# Altium schematic sheet BUCK CONVERTERS.SchDoc: Buck Converters
size 558 x 431 mm; CheckedBy: Lance Bantoto; Engineer: Cindy Li; Organization: UW Robotics; Address1: 200 University Avenue; Address2: Waterloo; Address3: Ontario; Address4: Canada N2L 3G6; DocumentNumber: 3; Revision: 1; SheetNumber: 3; SheetTotal: 23
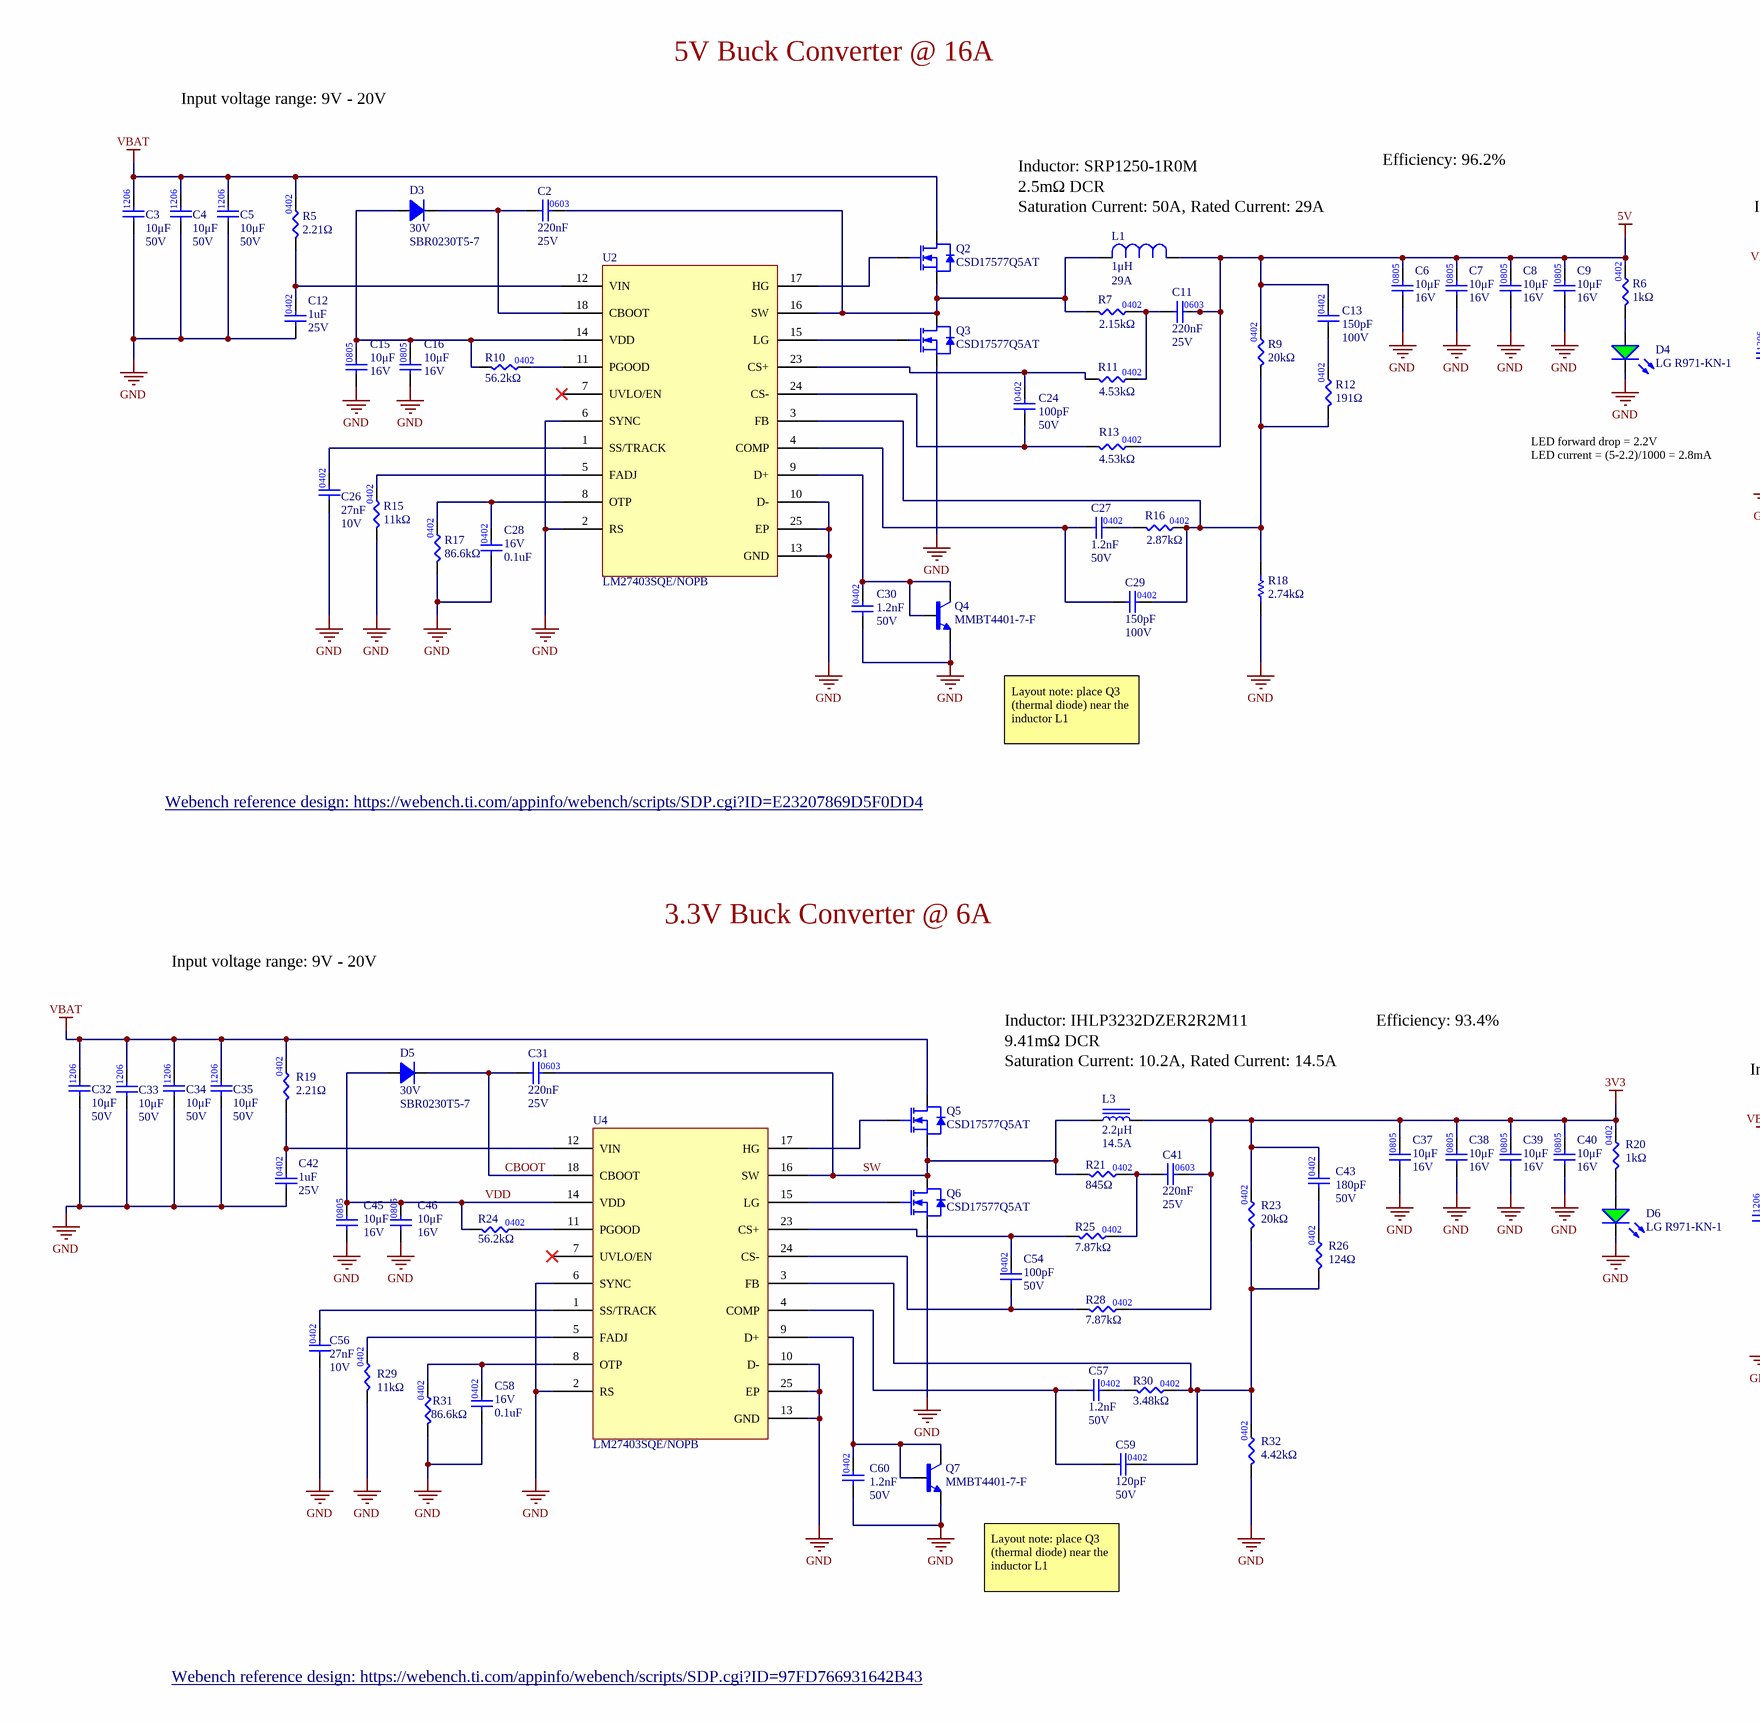
[diagram p0: BUCK CONVERTERS.SchDoc, left]
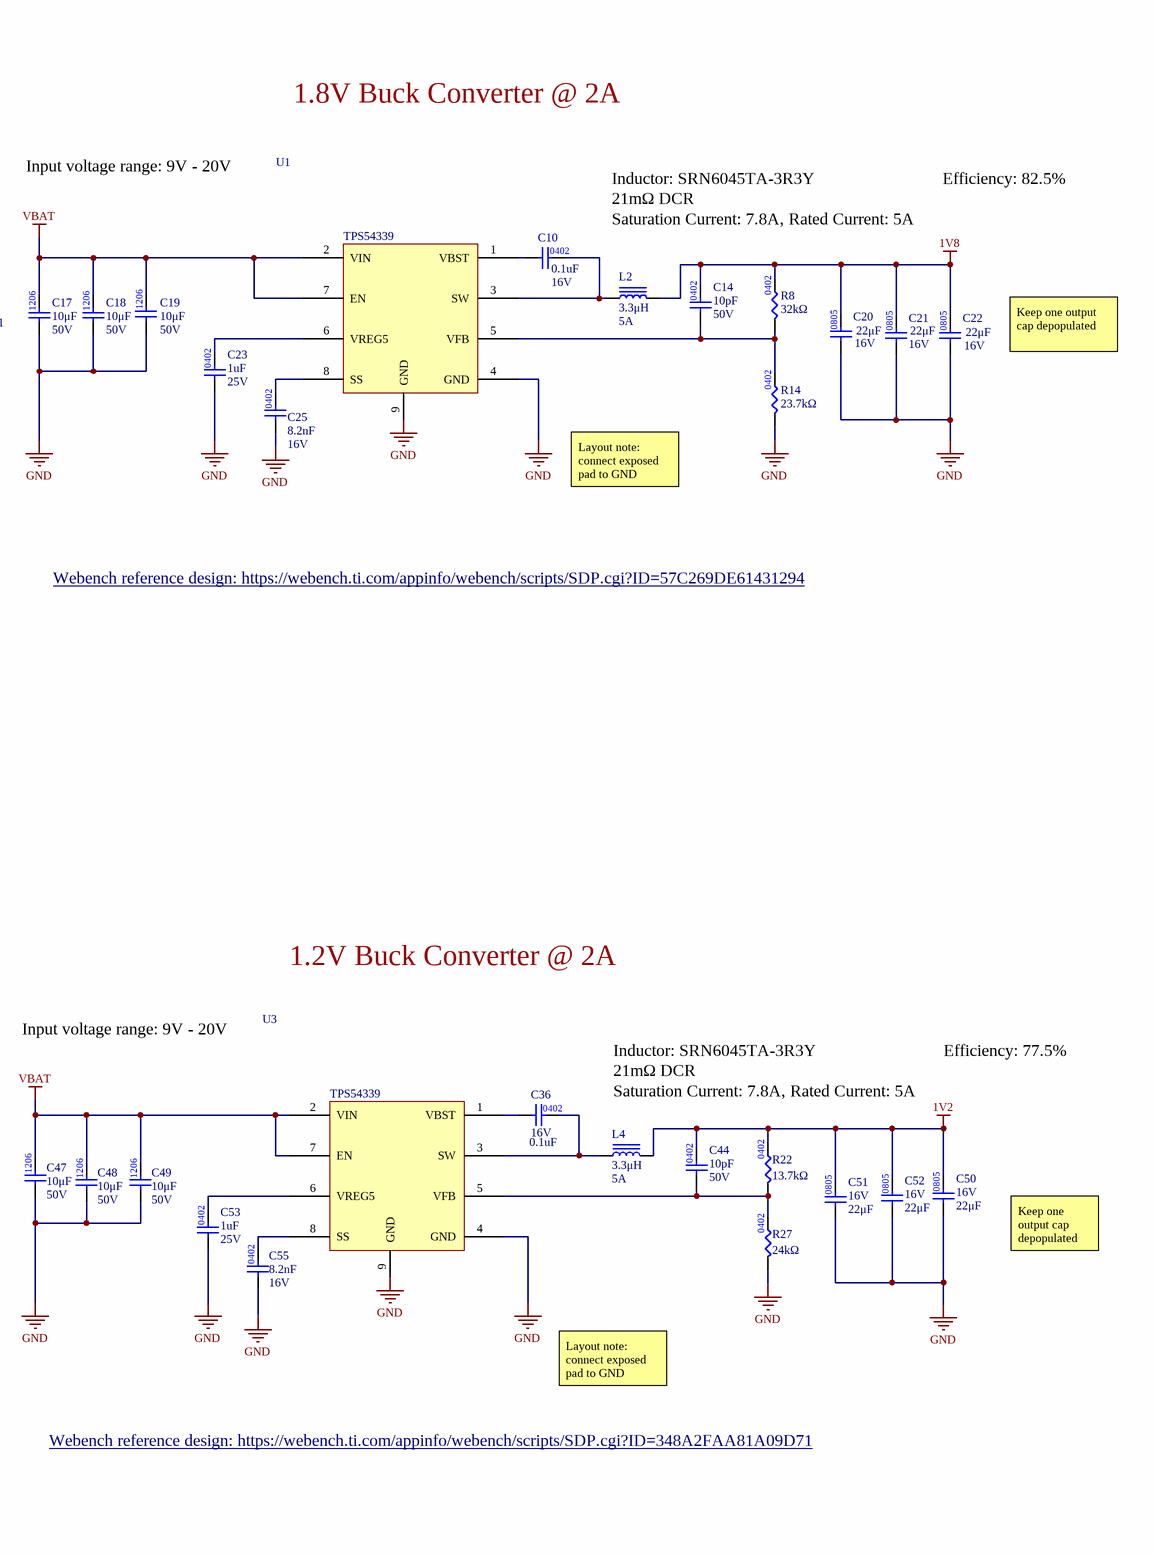
[diagram p1: BUCK CONVERTERS.SchDoc, right]

## Parts
C2  Capacitance: 220nF  Rated DC Voltage (URdc): 25V  [CAP0402]  (hidden comment: CAP_0.22uF_25V_X5R_0402)
C3  value 10μF  Voltage Rating: 50V  [CAP1210]  (hidden comment: CAP_10uF_50V_1210)
C4  value 10μF  Voltage Rating: 50V  [CAP1210]  (hidden comment: CAP_10uF_50V_1210)
C5  value 10μF  Voltage Rating: 50V  [CAP1210]  (hidden comment: CAP_10uF_50V_1210)
C6  value 10μF  Voltage Rating: 16V  [CAP2012]  (hidden comment: CAP_10uF_16V_0805)
C7  value 10μF  Voltage Rating: 16V  [CAP2012]  (hidden comment: CAP_10uF_16V_0805)
C8  value 10μF  Voltage Rating: 16V  [CAP2012]  (hidden comment: CAP_10uF_16V_0805)
C9  value 10μF  Voltage Rating: 16V  [CAP2012]  (hidden comment: CAP_10uF_16V_0805)
C10  Rated DC Voltage (URdc): 16V  Capacitance: 0.1uF  [CAP0402]  (hidden comment: CAP_0.1uF_16V_X7R_0402)
C11  Capacitance: 220nF  Rated DC Voltage (URdc): 25V  [CAP0402]  (hidden comment: CAP_0.22uF_25V_X5R_0402)
C12  Capacitance: 1uF  Voltage: 25V  [CAP0402]  (hidden comment: CAP_1uF_25V_0402)
C13  Capacitance: 150pF  Rated DC Voltage (URdc): 100V  [CAP0402]  (hidden comment: CAP_150pF_100V_NP0_0402)
C14  Capacitance: 10pF  Voltage: 50V  [CAP0402]  (hidden comment: CAP_10pF_50V_0402)
C15  value 10μF  Voltage Rating: 16V  [CAP2012]  (hidden comment: CAP_10uF_16V_0805)
C16  value 10μF  Voltage Rating: 16V  [CAP2012]  (hidden comment: CAP_10uF_16V_0805)
C17  value 10μF  Voltage Rating: 50V  [CAP1210]  (hidden comment: CAP_10uF_50V_1210)
C18  value 10μF  Voltage Rating: 50V  [CAP1210]  (hidden comment: CAP_10uF_50V_1210)
C19  value 10μF  Voltage Rating: 50V  [CAP1210]  (hidden comment: CAP_10uF_50V_1210)
C20  value 22μF  Voltage Rating: 16V  [CAP2012]  (hidden comment: CAP_22uF_16V_0805)
C21  value 22μF  Voltage Rating: 16V  [CAP2012]  (hidden comment: CAP_22uF_16V_0805)
C22  value 22μF  Voltage Rating: 16V  [CAP2012]  (hidden comment: CAP_22uF_16V_0805)
C23  Capacitance: 1uF  Voltage: 25V  [CAP0402]  (hidden comment: CAP_1uF_25V_0402)
C24  Capacitance: 100pF  Voltage: 50V  [CAP0402]  (hidden comment: CAP_100pF_50V_0402)
C25  Capacitance: 8.2nF  Voltage: 16V  [CAP0402]  (hidden comment: CAP_8.2nF_16V_0402)
C26  Capacitance: 27nF  Rated DC Voltage (URdc): 10V  [CAP0402]  (hidden comment: CAP_0.027uF_10V_X7R_0402)
C27  Capacitance: 1.2nF  Rated DC Voltage (URdc): 50V  [CAP0402]  (hidden comment: CAP_1.2nF_50V_X7R_0402)
C28  Rated DC Voltage (URdc): 16V  Capacitance: 0.1uF  [CAP0402]  (hidden comment: CAP_0.1uF_16V_X7R_0402)
C29  Capacitance: 150pF  Rated DC Voltage (URdc): 100V  [CAP0402]  (hidden comment: CAP_150pF_100V_NP0_0402)
C30  Capacitance: 1.2nF  Rated DC Voltage (URdc): 50V  [CAP0402]  (hidden comment: CAP_1.2nF_50V_X7R_0402)
C31  Capacitance: 220nF  Rated DC Voltage (URdc): 25V  [CAP0402]  (hidden comment: CAP_0.22uF_25V_X5R_0402)
C32  value 10μF  Voltage Rating: 50V  [CAP1210]  (hidden comment: CAP_10uF_50V_1210)
C33  value 10μF  Voltage Rating: 50V  [CAP1210]  (hidden comment: CAP_10uF_50V_1210)
C34  value 10μF  Voltage Rating: 50V  [CAP1210]  (hidden comment: CAP_10uF_50V_1210)
C35  value 10μF  Voltage Rating: 50V  [CAP0805]  (hidden comment: CAP_10uF_50V_1210)
C36  Rated DC Voltage (URdc): 16V  Capacitance: 0.1uF  [CAP0402]  (hidden comment: CAP_0.1uF_16V_X7R_0402)
C37  value 10μF  Voltage Rating: 16V  [CAP2012]  (hidden comment: CAP_10uF_16V_0805)
C38  value 10μF  Voltage Rating: 16V  [CAP2012]  (hidden comment: CAP_10uF_16V_0805)
C39  value 10μF  Voltage Rating: 16V  [CAP2012]  (hidden comment: CAP_10uF_16V_0805)
C40  value 10μF  Voltage Rating: 16V  [CAP2012]  (hidden comment: CAP_10uF_16V_0805)
C41  Capacitance: 220nF  Rated DC Voltage (URdc): 25V  [CAP0402]  (hidden comment: CAP_0.22uF_25V_X5R_0402)
C42  Capacitance: 1uF  Voltage: 25V  [CAP0402]  (hidden comment: CAP_1uF_25V_0402)
C43  Capacitance: 180pF  Voltage: 50V  [CAP0402]  (hidden comment: CAP_180pF_50V_0402)
C44  Capacitance: 10pF  Voltage: 50V  [CAP0402]  (hidden comment: CAP_10pF_50V_0402)
C45  value 10μF  Voltage Rating: 16V  [CAP2012]  (hidden comment: CAP_10uF_16V_0805)
C46  value 10μF  Voltage Rating: 16V  [CAP2012]  (hidden comment: CAP_10uF_16V_0805)
C47  value 10μF  Voltage Rating: 50V  [CAP1210]  (hidden comment: CAP_10uF_50V_1210)
C48  value 10μF  Voltage Rating: 50V  [CAP1210]  (hidden comment: CAP_10uF_50V_1210)
C49  value 10μF  Voltage Rating: 50V  [CAP1210]  (hidden comment: CAP_10uF_50V_1210)
C50  value 22μF  Voltage Rating: 16V  [CAP2012]  (hidden comment: CAP_22uF_16V_0805)
C51  value 22μF  Voltage Rating: 16V  [CAP2012]  (hidden comment: CAP_22uF_16V_0805)
C52  value 22μF  Voltage Rating: 16V  [CAP2012]  (hidden comment: CAP_22uF_16V_0805)
C53  Capacitance: 1uF  Voltage: 25V  [CAP0402]  (hidden comment: CAP_1uF_25V_0402)
C54  Capacitance: 100pF  Voltage: 50V  [CAP0402]  (hidden comment: CAP_100pF_50V_0402)
C55  Capacitance: 8.2nF  Voltage: 16V  [CAP0402]  (hidden comment: CAP_8.2nF_16V_0402)
C56  Capacitance: 27nF  Rated DC Voltage (URdc): 10V  [CAP0402]  (hidden comment: CAP_0.027uF_10V_X7R_0402)
C57  Capacitance: 1.2nF  Rated DC Voltage (URdc): 50V  [CAP0402]  (hidden comment: CAP_1.2nF_50V_X7R_0402)
C58  Rated DC Voltage (URdc): 16V  Capacitance: 0.1uF  [CAP0402]  (hidden comment: CAP_0.1uF_16V_X7R_0402)
C59  Capacitance: 120pF  Voltage: 50V  [CAP0402]  (hidden comment: CAP_120pF_50V_0402)
C60  Capacitance: 1.2nF  Rated DC Voltage (URdc): 50V  [CAP0402]  (hidden comment: CAP_1.2nF_50V_X7R_0402)
D3  value 30V  [SOD523]  (hidden comment: SBR0230T5-7)
D4  Manufacturer Part Number 1: LG R971-KN-1  [LED_0805_GREEN]  (hidden comment: DIO_LED_G)
D5  value 30V  [SOD523]  (hidden comment: SBR0230T5-7)
D6  Manufacturer Part Number 1: LG R971-KN-1  [LED_0805_GREEN]  (hidden comment: DIO_LED_G)
L1  Current Rating: 29A  Inductance: 1μH  [IND_BOURNS_SRP1250]  (hidden comment: IND_1uH_29A)
L2  Current Rating: 5A  Inductance: 3.3μH  [IND_SRN6045TA-3R3Y]  (hidden comment: IND_3.3uH_5A)
L3  Current Rating: 14.5A  Inductance: 2.2μH  [IND_VISHAY_IHLP3232DZER2R2M11]  (hidden comment: IND_2.2uH_14.5A)
L4  Current Rating: 5A  Inductance: 3.3μH  [IND_SRN6045TA-3R3Y]  (hidden comment: IND_3.3uH_5A)
Q2  Manufacturer Part Number 1: CSD17577Q5AT  [MOSFET_CSD19531Q5A]  (hidden comment: NMOS_30V_60A)
Q3  Manufacturer Part Number 1: CSD17577Q5AT  [MOSFET_CSD19531Q5A]  (hidden comment: NMOS_30V_60A)
Q4  MMBT4401-7-F  [MMBT4401-7-F]
Q5  Manufacturer Part Number 1: CSD17577Q5AT  [MOSFET_CSD19531Q5A]  (hidden comment: NMOS_30V_60A)
Q6  Manufacturer Part Number 1: CSD17577Q5AT  [MOSFET_CSD19531Q5A]  (hidden comment: NMOS_30V_60A)
Q7  MMBT4401-7-F  [MMBT4401-7-F]
R5  value 2.21Ω  [RES0402]  (hidden comment: RES_2.21Ω_0402_1%)
R6  Resistance: 1kΩ  [RES0402]  (hidden comment: RES_1kΩ_0402)
R7  value 2.15kΩ  [RES0402]  (hidden comment: RES_2.15kΩ_0402_1%)
R8  value 32kΩ  [RES0402]  (hidden comment: RES_32kΩ_0402_1%)
R9  value 20kΩ  [RES0402]  (hidden comment: RES_20kΩ_0402_1%)
R10  value 56.2kΩ  [RES0402]  (hidden comment: RES_56.2kΩ_0402_1%)
R11  value 4.53kΩ  [RES0402]  (hidden comment: RES_4.53kΩ_0402_1%)
R12  value 191Ω  [RES0402]  (hidden comment: RES_191Ω_0402_1%)
R13  value 4.53kΩ  [RES0402]  (hidden comment: RES_4.53kΩ_0402_1%)
R14  value 23.7kΩ  [RES0402]  (hidden comment: RES_23.7kΩ_0402_1%)
R15  value 11kΩ  [RES0402]  (hidden comment: RES_11kΩ_0402_1%)
R16  value 2.87kΩ  [RES0402]  (hidden comment: RES_2.87kΩ_0402_1%)
R17  value 86.6kΩ  [RES0402]  (hidden comment: RES_86.6kΩ_0402_1%)
R18  value 2.74kΩ  [RES0402]  (hidden comment: RES_2.74kΩ_0402_1%)
R19  value 2.21Ω  [RES0402]  (hidden comment: RES_2.21Ω_0402_1%)
R20  Resistance: 1kΩ  [RES0402]  (hidden comment: RES_1kΩ_0402)
R21  value 845Ω  [RES0402]  (hidden comment: RES_845Ω_0402_1%)
R22  value 13.7kΩ  [RES0402]  (hidden comment: RES_13.7kΩ_0402_1%)
R23  value 20kΩ  [RES0402]  (hidden comment: RES_20kΩ_0402_1%)
R24  value 56.2kΩ  [RES0402]  (hidden comment: RES_56.2kΩ_0402_1%)
R25  value 7.87kΩ  [RES0402]  (hidden comment: RES_7.87kΩ_0402_1%)
R26  value 124Ω  [RES0402]  (hidden comment: RES_124Ω_0402_1%)
R27  value 24kΩ  [RES0402]  (hidden comment: RES_24kΩ_0402_1%)
R28  value 7.87kΩ  [RES0402]  (hidden comment: RES_7.87kΩ_0402_1%)
R29  value 11kΩ  [RES0402]  (hidden comment: RES_11kΩ_0402_1%)
R30  value 3.48kΩ  [RES0402]  (hidden comment: RES_3.48kΩ_0402_1%)
R31  value 86.6kΩ  [RES0402]  (hidden comment: RES_86.6kΩ_0402_1%)
R32  value 4.42kΩ  [RES0402]  (hidden comment: RES_4.42kΩ_0402_1%)
U1  TPS54339  [VREG_LM5017MR/NOPB]
U2  LM27403SQE/NOPB  [QFN50P400X400X80-25N]
U3  TPS54339  [VREG_LM5017MR/NOPB]
U4  LM27403SQE/NOPB  [QFN50P400X400X80-25N]

## Nets
1V2: C44.2 C50.2 C51.2 C52.2 L4.2 R22.2
1V8: C14.2 C20.2 C21.2 C22.2 L2.2 R8.2
3V3: C37.2 C38.2 C39.2 C40.2 C41.2 C43.2 L3.2 R20.2 R23.2 R28.2
5V: C6.2 C7.2 C8.2 C9.2 C11.2 C13.2 L1.1 R6.2 R9.2 R13.2
GND: C3.1 C4.1 C5.1 C6.1 C7.1 C8.1 C9.1 C12.1 C15.1 C16.1 C17.1 C18.1 C19.1 C20.1 C21.1 C22.1 C23.1 C25.1 C26.1 C28.1 C30.1 C32.1 C33.1 C34.1 C35.1 C37.1 C38.1 C39.1 C40.1 C42.1 C45.1 C46.1 C47.1 C48.1 C49.1 C50.1 C51.1 C52.1 C53.1 C55.1 C56.1 C58.1 C60.1 D4.2(K) D6.2(K) Q3.1(Source) Q4.2 Q6.1(Source) Q7.2 R14.1 R15.1 R17.1 R18.1 R27.1 R29.1 R31.1 R32.1 U1.4(GND) U1.9(GND) U2.2(RS) U2.6(SYNC) U2.10(D-) U2.13(GND) U2.25(EP) U3.4(GND) U3.9(GND) U4.2(RS) U4.6(SYNC) U4.10(D-) U4.13(GND) U4.25(EP)
VBAT: C3.2 C4.2 C5.2 C17.2 C18.2 C19.2 C32.2 C33.2 C34.2 C35.2 C47.2 C48.2 C49.2 Q2.3(Drain) Q5.3(Drain) R5.2 R19.2 U1.2(VIN) U1.7(EN) U3.2(VIN) U3.7(EN)
CBOOT: C31.1 D5.1 U4.18(CBOOT)
SW: C31.2 L3.1 Q5.1(Source) Q6.3(Drain) R21.1 U4.16(SW)
VDD: C45.2 C46.2 D5.2 R24.1 U4.14(VDD)
NetC2_1: C2.1 D3.1 U2.18(CBOOT)
NetC2_2: C2.2 L1.2 Q2.1(Source) Q3.3(Drain) R7.1 U2.16(SW)
NetC10_1: C10.1 U1.1(VBST)
NetC10_2: C10.2 L2.1 U1.3(SW)
NetC11_1: C11.1 R7.2 R11.2
NetC12_2: C12.2 R5.1 U2.12(VIN)
NetC13_1: C13.1 R12.2
NetC14_1: C14.1 R8.1 R14.2 U1.5(VFB)
NetC15_2: C15.2 C16.2 D3.2 R10.1 U2.14(VDD)
NetC23_2: C23.2 U1.6(VREG5)
NetC24_1: C24.1 R13.1 U2.24(CS-)
NetC24_2: C24.2 R11.1 U2.23(CS+)
NetC25_2: C25.2 U1.8(SS)
NetC26_2: C26.2 U2.1(SS/TRACK)
NetC27_1: C27.1 C29.1 U2.4(COMP)
NetC27_2: C27.2 R16.1
NetC28_2: C28.2 R17.2 U2.8(OTP)
NetC29_2: C29.2 R9.1 R12.1 R16.2 R18.2 U2.3(FB)
NetC30_2: C30.2 Q4.1 Q4.3 U2.9(D+)
NetC36_1: C36.1 U3.1(VBST)
NetC36_2: C36.2 L4.1 U3.3(SW)
NetC41_1: C41.1 R21.2 R25.2
NetC42_2: C42.2 R19.1 U4.12(VIN)
NetC43_1: C43.1 R26.2
NetC44_1: C44.1 R22.1 R27.2 U3.5(VFB)
NetC53_2: C53.2 U3.6(VREG5)
NetC54_1: C54.1 R28.1 U4.24(CS-)
NetC54_2: C54.2 R25.1 U4.23(CS+)
NetC55_2: C55.2 U3.8(SS)
NetC56_2: C56.2 U4.1(SS/TRACK)
NetC57_1: C57.1 C59.1 U4.4(COMP)
NetC57_2: C57.2 R30.1
NetC58_2: C58.2 R31.2 U4.8(OTP)
NetC59_2: C59.2 R23.1 R26.1 R30.2 R32.2 U4.3(FB)
NetC60_2: C60.2 Q7.1 Q7.3 U4.9(D+)
NetD4_1: D4.1(A) R6.1
NetD6_1: D6.1(A) R20.1
NetQ2_2: Q2.2(Gate) U2.17(HG)
NetQ3_2: Q3.2(Gate) U2.15(LG)
NetQ5_2: Q5.2(Gate) U4.17(HG)
NetQ6_2: Q6.2(Gate) U4.15(LG)
NetR10_2: R10.2 U2.11(PGOOD)
NetR15_2: R15.2 U2.5(FADJ)
NetR24_2: R24.2 U4.11(PGOOD)
NetR29_2: R29.2 U4.5(FADJ)

Not connected (* = marked no-connect by the designer): U2 7(UVLO/EN)*; U4 7(UVLO/EN)*

## Notes on the sheet
- 5V Buck Converter @ 16A
- Input voltage range: 9V - 20V
- Inductor: SRP1250-1R0M
- 2.5mΩ DCR
- Efficiency: 96.2%
- 1.8V Buck Converter @ 2A
- (near L1) Saturation Current: 50A, Rated Current: 29A
- Inductor: SRN6045TA-3R3Y
- 21mΩ DCR
- Saturation Current: 7.8A, Rated Current: 5A
- Efficiency: 82.5%
- Keep one output cap depopulated
- LED forward drop = 2.2V
  LED current = (5-2.2)/1000 = 2.8mA
- Layout note: connect exposed pad to GND
- Webench reference design: https://webench.ti.com/appinfo/webench/scripts/SDP.cgi?ID=57C269DE61431294 <https://webench.ti.com/appinfo/webench/scripts/SDP.cgi?ID=57C269DE61431294>
- Layout note: place Q3 (thermal diode) near the inductor L1
- Webench reference design: https://webench.ti.com/appinfo/webench/scripts/SDP.cgi?ID=E23207869D5F0DD4 <https://webench.ti.com/appinfo/webench/scripts/SDP.cgi?ID=E23207869D5F0DD4>
- 3.3V Buck Converter @ 6A
- 1.2V Buck Converter @ 2A
- Inductor: IHLP3232DZER2R2M11
- 9.41mΩ DCR
- (near L3) Saturation Current: 10.2A, Rated Current: 14.5A
- Efficiency: 93.4%
- Efficiency: 77.5%
- Webench reference design: https://webench.ti.com/appinfo/webench/scripts/SDP.cgi?ID=348A2FAA81A09D71 <https://webench.ti.com/appinfo/webench/scripts/SDP.cgi?ID=348A2FAA81A09D71>
- Webench reference design: https://webench.ti.com/appinfo/webench/scripts/SDP.cgi?ID=97FD766931642B43 <https://webench.ti.com/appinfo/webench/scripts/SDP.cgi?ID=97FD766931642B43>
- University of Waterloo Robotics Team
- 200 University Ave W
- REV
- PROJECT
- Waterloo, Ontario, Canada
- N2L 3G1
- DOCUMENT
- ENGINEER
- REVIEWER
- MODIFIED
- SHEET
- OF
- (in symbol CAP_0.22uF_25V_X5R_0402) 0603
- (in symbol CAP_10uF_50V_1210) 1206

## Library data of the parts
C2 C11 C31 C41 = CAP_0.22uF_25V_X5R_0402: 0.22 µF ±10% 25V Ceramic Capacitor X5R 0402 (1005 Metric); Manufacturer: Yageo; Manufacturer Part Number: CC0402KRX5R8BB224; Multilayer: Yes; Negative Tolerance: 5; Positive Tolerance: 5%; Supplier 1: Digi-Key; Supplier Part Number 1: 311-3341-1-ND; RoHS: Yes; Category: Ceramic Capacitors; Pricing 1: 1=0.10000, 10=0.04000, 50=0.02200, 100=0.01800, 500=0.01288, 1000=0.01012, 2500=0.00920, 5000=0.00846 (USD); Mount: Surface Mount; Number of Pins: 2; Dielectric Material: Ceramic; Package Shape: Rectangular; Min Operating Temperature: -55°C; Max Operating Temperature: 125°C; JESD-609 Code: e3; Capacitor Type: Ceramic; Package Style: SMTMeter; Temperature Characteristics Code: X5R; Termination: Wraparound; Length: 1mm; Width: 0.5mm; Height: 0.5mm; REACH SVHC: Yes; RoHS Compliant: Yes; Size Code: 0402
C3-C5 C17-C19 C32-C35 C47-C49 = CAP_10uF_50V_1210: CAP CER 10UF 50V X7R 1210; Manufacturer 1: Murata Electronics; Manufacturer Part Number 1: GRM32ER71H106MA12L; Dielectric: X7R; Supplier 1: Digi-Key; Supplier Part Number 1: 490-12775-1-ND
C6-C9 C37-C40 C45 C46 = CAP_10uF_16V_0805: CAP CER 10UF 16V X5R 0805; Manufacturer 1: Yageo; Manufacturer Part Number 1: CC0805KKX5R7BB106; Package/Footprint: 0805; Dielectric: X5R; Supplier 1: Digi-Key; Supplier Part Number 1: 311-1865-1-ND; Mounting Type: SMD
C10 C28 C36 C58 = CAP_0.1uF_16V_X7R_0402: Ceramic Capacitor, Ceramic; Manufacturer: Taiyo Yuden; Manufacturer Part Number: LMK212AC6106MD-T; Multilayer: Yes; Negative Tolerance: 10%; Temperature Characteristics Code: X7R; Supplier 1: Digi-Key; Supplier Part Number 1: 587-6337-1-ND; RoHS: Yes; Stock 1: 703; Pricing 1: 1=0.29000, 10=0.20100, 50=0.12060, 100=0.10180, 500=0.06966, 1000=0.06163 (USD); ComponentLink1URL: https://datasheet.ciiva.com:443/pdfs/VipMasterIC/IC/TAIY/TAIY-S-A0009099504/TAIY-S-A0009099407-1.pdf?src-supplier=IHS+Markit; ComponentLink1Description: https://datasheet.ciiva.com:443/pdfs/VipMasterIC/IC/TAIY/TAIY-S-A0009099504/TAIY-S-A0009099407-1.pdf?src-supplier=IHS+Markit; ComponentLink2URL: https://ds.yuden.co.jp/TYCOMPAS/ut/detail?pn=LMK212AC6106MD-T &amp;u=M&src-supplier=Digi-Key; ComponentLink2Description: https://ds.yuden.co.jp/TYCOMPAS/ut/detail?pn=LMK212AC6106MD-T &amp;u=M&src-supplier=Digi-Key; Supplier 2: Digi-Key; Supplier Part Number 2: 1292-1630-1-ND; Category: Ceramic Capacitors; Stock 2: 20327886; Pricing 2: 1=0.10000, 10=0.02800, 50=0.01500, 100=0.01220, 500=0.00876, 1000=0.00688, 2500=0.00625, 5000=0.00575 (USD); Mount: Surface Mount; Number of Pins: 2; Dielectric Material: Ceramic; Package Shape: Rectangular; Terminal Finish: Nickel; Min Operating Temperature: -55°C; Max Operating Temperature: 125°C; JESD-609 Code: e3; Capacitor Type: Ceramic; Package Style: SMTMeter; Packaging: Tape and Reel; Positive Tolerance: 10%; Termination: Wraparound; Length: 1mm; Width: 0.5mm; Height: 0.5mm; REACH SVHC: Yes; RoHS Compliant: Yes; ComponentLink3URL: https://datasheet.ciiva.com:443/pdfs/VipMasterIC/IC/WATC/WATC-S-A0009550342/WATC-S-A0009550342-1.pdf?src-supplier=IHS+Markit; ComponentLink3Description: https://datasheet.ciiva.com:443/pdfs/VipMasterIC/IC/WATC/WATC-S-A0009550342/WATC-S-A0009550342-1.pdf?src-supplier=IHS+Markit; ComponentLink4URL: http://www.farnell.com/datasheets/2340522.pdf?src-supplier=Farnell; ComponentLink4Description: http://www.farnell.com/datasheets/2340522.pdf?src-supplier=Farnell; ComponentLink5URL: http://components.arrow.com/part/dataview/0323_00654690?src-supplier=Arrow+Europe; ComponentLink5Description: http://components.arrow.com/part/dataview/0323_00654690?src-supplier=Arrow+Europe; ComponentLink6URL: https://www.verical.com/server-webapp/html/getDatasheet?partID=415228&src-supplier=Verical; ComponentLink6Description: https://www.verical.com/server-webapp/html/getDatasheet?partID=415228&src-supplier=Verical; ComponentLink7URL: http://www.passivecomponent.com/indexsea/0402B104K160CT-IN.pdf?src-supplier=Digi-Key; ComponentLink7Description: http://www.passivecomponent.com/indexsea/0402B104K160CT-IN.pdf?src-supplier=Digi-Key; ComponentLink8URL: http://www.passivecomponent.com/wp-content/uploads/2018/10/MLCC.pdf?src-supplier=Digi-Key; ComponentLink8Description: http://www.passivecomponent.com/wp-content/uploads/2018/10/MLCC.pdf?src-supplier=Digi-Key; ComponentLink9URL: http://www.farnell.com/datasheets/2340522.pdf?src-supplier=Element14; ComponentLink9Description: http://www.farnell.com/datasheets/2340522.pdf?src-supplier=Element14; ComponentLink10URL: http://www.farnell.com/datasheets/2340522.pdf?src-supplier=Newark; ComponentLink10Description: http://www.farnell.com/datasheets/2340522.pdf?src-supplier=Newark; Size Code: 0402; Supplier 3: Digi-Key; Supplier Part Number 3: 445-173645-1-ND; Stock 3: 3627; Pricing 3: 1=0.20000, 10=0.14200, 50=0.08080, 100=0.06700, 500=0.04696, 1000=0.03888, 2500=0.03619, 5000=0.03311 (USD); ComponentLink11URL: https://datasheet.ciiva.com:443/pdfs/VipMasterIC/IC/TDKC/TDKC-S-A0007785269/TDKC-S-A0007785269-1.pdf?src-supplier=IHS+Markit; ComponentLink11Description: https://datasheet.ciiva.com:443/pdfs/VipMasterIC/IC/TDKC/TDKC-S-A0007785269/TDKC-S-A0007785269-1.pdf?src-supplier=IHS+Markit; ComponentLink12URL: https://product.tdk.com/info/en/catalog/spec/mlccspec_commercial_soft_en.pdf?src-supplier=Digi-Key; ComponentLink12Description: https://product.tdk.com/info/en/catalog/spec/mlccspec_commercial_soft_en.pdf?src-supplier=Digi-Key
C12 C23 C42 C53 = CAP_1uF_25V_0402: ±10% 25V Ceramic Capacitor X5R 0402 (1005 Metric); Manufacturer 1: TDK Corporation; Manufacturer Part Number 1: C1005X5R1E105K050BE; Supplier 1: Digi-Key; Supplier Part Number 1: 445-175215-1-ND; Package: 0402
C13 C29 = CAP_150pF_100V_NP0_0402: ±5% 100V Ceramic Capacitor C0G, NP0 0402 (1005 Metric); Manufacturer: Yageo; Manufacturer Part Number: CGA2B2C0G2A151J050BE; Multilayer: Yes; Negative Tolerance: 5; Temperature Characteristics Code: X7R; Supplier 1: Digi-Key; Supplier Part Number 1: 445-175654-1-ND; RoHS: Yes; Category: Ceramic Capacitors; Pricing 1: 1=0.10000, 10=0.04000, 50=0.02200, 100=0.01800, 500=0.01288, 1000=0.01012, 2500=0.00920, 5000=0.00846 (USD); Mount: Surface Mount; Number of Pins: 2; Dielectric Material: Ceramic; Package Shape: Rectangular; Min Operating Temperature: -55°C; Max Operating Temperature: 125°C; JESD-609 Code: e3; Capacitor Type: Ceramic; Package Style: SMTMeter; Positive Tolerance: 5%; Termination: Wraparound; Length: 1mm; Width: 0.5mm; Height: 0.5mm; REACH SVHC: Yes; RoHS Compliant: Yes; Size Code: 0402
C14 C44 = CAP_10pF_50V_0402: Ceramic Capacitor, Multilayer, Ceramic, 50V, 1% +Tol, 1% -Tol, C0G, 30ppm/Cel TC, 0.00001uF, Surface Mount, 0402; Package: 0402
C15 C16 = CAP_10uF_16V_0805: CAP CER 10UF 16V X5R 0805; Manufacturer Part Number 1: CC0805KKX5R7BB106; Manufacturer 1: Yageo; Package/Footprint: 0805; Supplier 1: Digi-Key; Supplier Part Number 1: 311-1865-1-ND; Dielectric: X5R; Mounting Type: SMD
C20-C22 C50-C52 = CAP_22uF_16V_0805: CAP CER 22UF 16V X5R 0805; Manufacturer 1: Murata Electronics; Manufacturer Part Number 1: GRM219R61C226ME15L; Package/Footprint: 0805; Supplier 1: Digi-Key; Supplier Part Number 1: 490-9952-1-ND; Mounting Type: SMD; Dielectric: X5R
C24 C54 = CAP_100pF_50V_0402: 100 pF ±10% 50V Ceramic Capacitor X7R 0402 (1005 Metric); Manufacturer 1: AVX Corporation; Manufacturer Part Number 1: 04025C101KAT2A; Supplier 1: Digi-Key; Supplier Part Number 1: 478-1089-1-ND; Package: 0402
C25 C55 = CAP_8.2nF_16V_0402: 8200 pF ±10% 16V Ceramic Capacitor X7R 0402 (1005 Metric); Manufacturer 1: Yageo; Manufacturer Part Number 1: CC0402KRX7R7BB822; Supplier 1: Digi-Key; Supplier Part Number 1: 311-1041-1-ND; Package: 0402
C26 C56 = CAP_0.027uF_10V_X7R_0402: 0.027 µF ±10% 10V Ceramic Capacitor X7R 0402 (1005 Metric); Manufacturer: Yageo; Manufacturer Part Number: CC0402KRX7R6BB273; Multilayer: Yes; Supplier 1: Digi-Key; Supplier Part Number 1: 311-3794-1-ND; RoHS: Yes; Category: Ceramic Capacitors; Pricing 1: 1=0.10000, 10=0.04000, 50=0.02200, 100=0.01800, 500=0.01288, 1000=0.01012, 2500=0.00920, 5000=0.00846 (USD); Mount: Surface Mount; Number of Pins: 2; Dielectric Material: Ceramic; Package Shape: Rectangular; Min Operating Temperature: -55°C; Max Operating Temperature: 125°C; JESD-609 Code: e3; Capacitor Type: Ceramic; Negative Tolerance: 10%; Package Style: SMTMeter; Positive Tolerance: 10%; Temperature Characteristics Code: X7R; Termination: Wraparound; Length: 1mm; Width: 0.5mm; Height: 0.5mm; REACH SVHC: Yes; RoHS Compliant: Yes; Size Code: 0402
C27 C30 C57 C60 = CAP_1.2nF_50V_X7R_0402: 1200 pF ±5% 50V Ceramic Capacitor X7R 0402 (1005 Metric); Manufacturer: Yageo; Manufacturer Part Number: CC0402JRX7R9BB122; Multilayer: Yes; Negative Tolerance: 5; Supplier 1: Digi-Key; Supplier Part Number 1: 311-3762-1-ND; RoHS: Yes; Category: Ceramic Capacitors; Pricing 1: 1=0.10000, 10=0.04000, 50=0.02200, 100=0.01800, 500=0.01288, 1000=0.01012, 2500=0.00920, 5000=0.00846 (USD); Mount: Surface Mount; Number of Pins: 2; Dielectric Material: Ceramic; Package Shape: Rectangular; Min Operating Temperature: -55°C; Max Operating Temperature: 125°C; JESD-609 Code: e3; Capacitor Type: Ceramic; Package Style: SMTMeter; Positive Tolerance: 5%; Temperature Characteristics Code: X7R; Termination: Wraparound; Length: 1mm; Width: 0.5mm; Height: 0.5mm; REACH SVHC: Yes; RoHS Compliant: Yes; Size Code: 0402
C43 = CAP_180pF_50V_0402: 180 pF ±10% 50V Ceramic Capacitor X7R 0402 (1005 Metric); Manufacturer 1: AVX Corporation; Manufacturer Part Number 1: 04025C181KAT2A; Supplier 1: Digi-Key; Supplier Part Number 1: 478-1092-1-ND; Package: 0402
C59 = CAP_120pF_50V_0402: 120 pF ±10% 50V Ceramic Capacitor X7R 0402 (1005 Metric); Manufacturer 1: AVX Corporation; Manufacturer Part Number 1: 04025C121KAT2A; Supplier 1: Digi-Key; Supplier Part Number 1: 478-1090-1-ND; Package: 0402
D3 D5 = DIO_30V_200mA: Diode Super Barrier 30 V 200mA Surface Mount SOD-523; Manufacturer 1: Diodes Incorporated; Supplier 1: Digi-Key; Supplier Part Number 1: SBR0230T5-7TR-ND; Manufacturer Part Number 1: SBR0230T5-7
D4 D6 = DIO_LED_G: LED GREEN DIFFUSED 0805 SMD; Manufacturer 1: OSRAM; Forward Voltage Drop: 2.2V; Package/Footprint: 0805; Supplier Part Number 1: 475-1410-1-ND; Supplier 1: Digi-Key; Mounting Type: SMD
L1 = IND_1uH_29A: FIXED IND 1UH 29A 2.5 MOHM SMD; Manufacturer 1: Bourns Inc.; Manufacturer Part Number 1: SRP1250-1R0M; Inductance Tolerance: 20%; Saturation Current: 50A; Test Frequency: 100kHz; DC Resistance (DCR): 2.5mOhm; Mounting Type: SMD; Supplier 1: Digi-Key; Supplier Part Number 1: SRP1250-1R0MCT-ND
L2 L4 = IND_3.3uH_5A: FIXED IND 3.3UH 5A 21 MOHM SMD; Manufacturer 1: Bourns Inc.; Manufacturer Part Number 1: SRN6045TA-3R3Y; DC Resistance (DCR): 21mOhm; Inductance Tolerance: 30%; Saturation Current: 7.8A; Test Frequency: 1MHz; Mounting Type: SMD; Supplier 1: Digi-Key; Supplier Part Number 1: SRN6045TA-3R3YCT-ND
L3 = IND_2.2uH_14.5A: INDUCTOR 2.2UH 14.5A 9.41 MOHM; Manufacturer 1: Vishay Dale; Manufacturer Part Number 1: IHLP3232DZER2R2M11; Inductance Tolerance: 20%; Saturation Current: 10.2A; DC Resistance (DCR): 9.41mOhm; Mounting Type: SMD; Supplier 1: Digi-Key; Supplier Part Number 1: 541-1350-1-ND
Q2 Q3 Q5 Q6 = NMOS_30V_60A: MOSFET N-CH 30V 60A 8VSON; Manufacturer 1: Texas Instruments; Package/Footprint: 8-PowerTDFN; Vgs (Max): ±20V; Supplier 1: Digi-Key; Supplier Part Number 1: 296-38337-1-ND; Mounting Type: SMD; Verified: No; Id: 60A; Vdss: 30V
Q4 Q7 = MMBT4401-7-F: Bipolar (BJT) Transistor NPN 40 V 600 mA 250MHz 310 mW Surface Mount SOT-23-3; Manufacturer 1: Diodes Incorporated; Current - Collector Cutoff (Max): 100nA; Vce Saturation (Max) @ Ib, Ic: 750mV @ 50mA, 500mA; Current - Collector (Ic) (Max): 600mA; Manufacturer Part Number 1: MMBT4401-7-F; Supplier 1: Digi-Key; Supplier Part Number 1: MMBT4401-FDICT-ND; Frequency - Transition: 250MHz
R5 R19 = RES_2.21Ω_0402_1%: RES 2.21 OHM 1% 1/16W 0402; Manufacturer Part Number 1: RMCF0402FT2R21; Manufacturer 1: Yageo; Power: 0.063W, 1/16W; Package/Footprint: 0402; Supplier 1: Digi-Key; Supplier Part Number 1: RMCF0402FT2R21CT-ND; Mounting Type: SMD; Tolerance: 1%
R6 R20 = RES_1kΩ_0402: Fixed Resistor, Metal Glaze/thick Film, 0.063W, 1000ohm, 50V, 1% +/-Tol, 100ppm/Cel, Surface Mount, 0402; Manufacturer: Stackpole Electronics; Manufacturer Part Number: RMCF0402FT1K00; Rated Power Dissipation (P): 63mW; Rated Temperature: 70°C; Temperature Coefficient: 100ppm/°C; Package Height: 0.3mm; Package Length: 1mm; Package Width: 0.5mm; Reference Standard: AEC-Q200; Supplier 1: Digi-Key; Supplier Part Number 1: RMCF0402FT1K00CT-ND; RoHS: Yes; Category: Chip SMD Resistors; Stock 1: 277; Pricing 1: 1=0.10000, 10=0.01500, 100=0.00610, 1000=0.00274, 2500=0.00238, 5000=0.00197 (USD); Mount: Surface Mount; Number of Pins: 2; Package Shape: Rectangular; Terminal Finish: Nickel; Min Operating Temperature: -55°C; Max Operating Temperature: 155°C; Tolerance: 1%; JESD-609 Code: e3; Resistor Type: FIXED RESISTOR; Construction: Rectangular; Package Style: SMTMeter; Packaging: Tape and Reel; Technology: METAL GLAZE/THICK FILM; Termination: Wraparound; Working Voltage: 50V; REACH SVHC: Yes; RoHS Compliant: Yes; ComponentLink1URL: https://datasheet.ciiva.com:443/pdfs/VipMasterIC/IC/SEIE/SEIE-S-A0009541969/SEIE-S-A0009541969-1.pdf?src-supplier=IHS+Markit; ComponentLink1Description: https://datasheet.ciiva.com:443/pdfs/VipMasterIC/IC/SEIE/SEIE-S-A0009541969/SEIE-S-A0009541969-1.pdf?src-supplier=IHS+Markit; ComponentLink2URL: https://datasheet.ciiva.com/15193/getdatasheetpartid-365385-15193418.pdf?src-supplier=Verical; ComponentLink2Description: https://datasheet.ciiva.com/15193/getdatasheetpartid-365385-15193418.pdf?src-supplier=Verical; ComponentLink3URL: https://datasheet.ciiva.com/24336/sei-rmcp-24336266.pdf?src-supplier=Onlinecomponents.com; ComponentLink3Description: https://datasheet.ciiva.com/24336/sei-rmcp-24336266.pdf?src-supplier=Onlinecomponents.com; Size Code: 0402
R7 = RES_2.15kΩ_0402_1%: RES SMD 2.15K OHM 1% 1/16W 0402; Manufacturer Part Number 1: RC0402FR-072K15L; Manufacturer 1: Yageo; Power: 0.063W, 1/16W; Package/Footprint: 0402; Supplier 1: Digi-Key; Supplier Part Number 1: YAG3097CT-ND; Mounting Type: SMD; Tolerance: 1%
R8 = RES_32kΩ_0402_1%: RES 32K OHM 1% 1/16W 0402; Manufacturer 1: Vishay Dale; Manufacturer Part Number 1: RN73H1ETTP3202F50; Package/Footprint: 0402; Supplier 1: Digi-Key; Supplier Part Number 1: 2019-RN73H1ETTP3202F50CT-ND; Tolerance: 1%
R9 R23 = RES_20kΩ_0402_1%: RES SMD 20K OHM 1% 1/16W 0402; Manufacturer Part Number 1: RC0402FR-0720KL; Manufacturer 1: Yageo; Power: 0.063W, 1/16W; Package/Footprint: 0402; Supplier 1: Digi-Key; Supplier Part Number 1: 311-20.0KLRCT-ND; Mounting Type: SMD; Tolerance: 1%
R10 R24 = RES_56.2kΩ_0402_1%: RES SMD 56.2K OHM 1% 1/16W 0402; Manufacturer Part Number 1: RC0402FR-0756K2L; Manufacturer 1: Yageo; Power: 0.063W, 1/16W; Package/Footprint: 0402; Supplier 1: Digi-Key; Supplier Part Number 1: YAG3187CT-ND; Mounting Type: SMD; Tolerance: 1%
R11 R13 = RES_4.53kΩ_0402_1%: RES SMD 4.53K OHM 1% 1/16W 0402; Manufacturer 1: Yageo; Manufacturer Part Number 1: RC0402FR-074K53L; Package/Footprint: 0402; Supplier 1: Digi-Key; Supplier Part Number 1: 311-4.53KLRCT-ND; Tolerance: 1%
R12 = RES_191Ω_0402_1%: RES SMD 191 OHM 1% 1/16W 0402; Manufacturer Part Number 1: RC0402FR-07191RL; Manufacturer 1: Yageo; Power: 0.063W, 1/16W; Package/Footprint: 0402; Supplier 1: Digi-Key; Supplier Part Number 1: YAG3023CT-ND; Mounting Type: SMD; Tolerance: 1%
R14 = RES_23.7kΩ_0402_1%: RES 23.7K OHM 1% 1/16W 0402; Manufacturer Part Number 1: RMCF0402FT23K7; Manufacturer 1: Stackpole Electronics Inc; Power: 0.063W, 1/16W; Package/Footprint: 0402; Supplier 1: Digi-Key; Supplier Part Number 1: RMCF0402FT23K7CT-ND; Mounting Type: SMD; Tolerance: 1%
R15 R29 = RES_11kΩ_0402_1%: RES 11K OHM 1% 1/16W 0402; Manufacturer Part Number 1: RMCF0402FT11K0; Manufacturer 1: Stackpole Electronics Inc; Power: 0.063W, 1/16W; Package/Footprint: 0402; Supplier 1: Digi-Key; Supplier Part Number 1: RMCF0402FT11K0CT-ND; Mounting Type: SMD; Tolerance: 1%
R16 = RES_2.87kΩ_0402_1%: RES SMD 2.87K OHM 1% 1/16W 0402; Manufacturer 1: Yageo; Manufacturer Part Number 1: RC0402FR-072K87L; Package/Footprint: 0402; Supplier 1: Digi-Key; Supplier Part Number 1: YAG3105CT-ND; Tolerance: 1%
R17 R31 = RES_86.6kΩ_0402_1%: RES SMD 86.6K OHM 1% 1/16W 0402; Manufacturer Part Number 1: RC0402FR-0786K6L; Manufacturer 1: Yageo; Power: 0.063W, 1/16W; Package/Footprint: 0402; Supplier 1: Digi-Key; Supplier Part Number 1: YAG3249CT-ND; Mounting Type: SMD; Tolerance: 1%
R18 = RES_2.74kΩ_0402_1%: RES 2.74K OHM 1% 1/16W 0402; Manufacturer Part Number 1: RMCF0402FT2K74; Manufacturer 1: Stackpole Electronics Inc; Power: 0.063W, 1/16W; Package/Footprint: 0402; Supplier 1: Digi-Key; Supplier Part Number 1: RMCF0402FT2K74CT-ND; Mounting Type: SMD; Tolerance: 1%
R21 = RES_845Ω_0402_1%: RES SMD 845 OHM 1% 1/16W 0402; Manufacturer Part Number 1: CRCW0402845RFKED; Manufacturer 1: Vishay Dale; Power: 0.063W, 1/16W; Package/Footprint: 0402; Supplier 1: Digi-Key; Supplier Part Number 1: 541-845LCT-ND; Mounting Type: SMD; Tolerance: 1%
R22 = RES_13.7kΩ_0402_1%: RES SMD 13.7K OHM 1% 1/16W 0402; Manufacturer Part Number 1: RC0402FR-0713K7L; Manufacturer 1: Yageo; Power: 0.063W, 1/16W; Package/Footprint: 0402; Supplier 1: Digi-Key; Supplier Part Number 1: 311-13.7KLRCT-ND; Mounting Type: SMD; Tolerance: 1%
R25 R28 = RES_7.87kΩ_0402_1%: RES 7.87K OHM 1% 1/16W 0402; Manufacturer Part Number 1: RMCF0402FT7K87; Manufacturer 1: Vishay Dale; Power: 0.063W, 1/16W; Package/Footprint: 0402; Supplier 1: Digi-Key; Supplier Part Number 1: RMCF0402FT7K87CT-ND; Mounting Type: SMD; Tolerance: 1%
R26 = RES_124Ω_0402_1%: RES SMD 124 OHM 1% 1/16W 0402; Manufacturer Part Number 1: RC0402FR-07124RL; Manufacturer 1: Vishay Dale; Power: 0.063W, 1/16W; Package/Footprint: 0402; Supplier 1: Digi-Key; Supplier Part Number 1: 311-124LRCT-ND; Mounting Type: SMD; Tolerance: 1%
R27 = RES_24kΩ_0402_1%: RES SMD 24K OHM 1% 1/16W 0402; Manufacturer Part Number 1: RC0402FR-0724KL; Manufacturer 1: Yageo; Power: 0.063W, 1/16W; Package/Footprint: 0402; Supplier 1: Digi-Key; Supplier Part Number 1: 311-24KLRCT-ND; Mounting Type: SMD; Tolerance: 1%
R30 = RES_3.48kΩ_0402_1%: RES SMD 3.48K OHM 1% 1/16W 0402; Manufacturer Part Number 1: RC0402FR-073K48L; Manufacturer 1: Vishay Dale; Power: 0.063W, 1/16W; Package/Footprint: 0402; Supplier 1: Digi-Key; Supplier Part Number 1: YAG3148CT-ND; Mounting Type: SMD; Tolerance: 1%
R32 = RES_4.42kΩ_0402_1%: RES 4.42K OHM 1% 1/16W 0402; Manufacturer Part Number 1: RMCF0402FT4K42; Manufacturer 1: Stackpole Electronics Inc; Power: 0.063W, 1/16W; Package/Footprint: 0402; Supplier 1: Digi-Key; Supplier Part Number 1: RMCF0402FT4K42CT-ND; Mounting Type: SMD; Tolerance: 1%
U1 U3 = TPS54339: IC REG BUCK ADJUSTABLE 3A 8SOPWR; Manufacturer 1: Texas Instruments; Manufacturer Part Number 1: TPS54339DDAR; Input Voltage (Min): 4.5V; Input Voltage (Max): 23V; Output Voltage (Min/Fixed): 0.76V; Output Voltage (Max): 7V; Switching Frequency: 600kHz; Supplier 1: Digi-Key; Supplier Part Number 1: 296-35686-1-ND; Output Current: 3A; Package: 8-PowerSOIC
U2 U4 = LM27403SQE/NOPB: Buck Regulator Positive Output Step-Down - DC-DC Controller IC 24-WQFN (4x4); Manufacturer 1: Texas Instruments; Supply Voltage: 3V - 20V; Switching Frequency: 200kHz - 1.2MHz; Max Duty Cycle: 93%; Manufacturer Part Number 1: LM27403SQE/NOPB; Supplier Part Number 1: 296-37066-1-ND; Supplier 1: Digi-Key; Package: 24-WQFN Exposed Pad